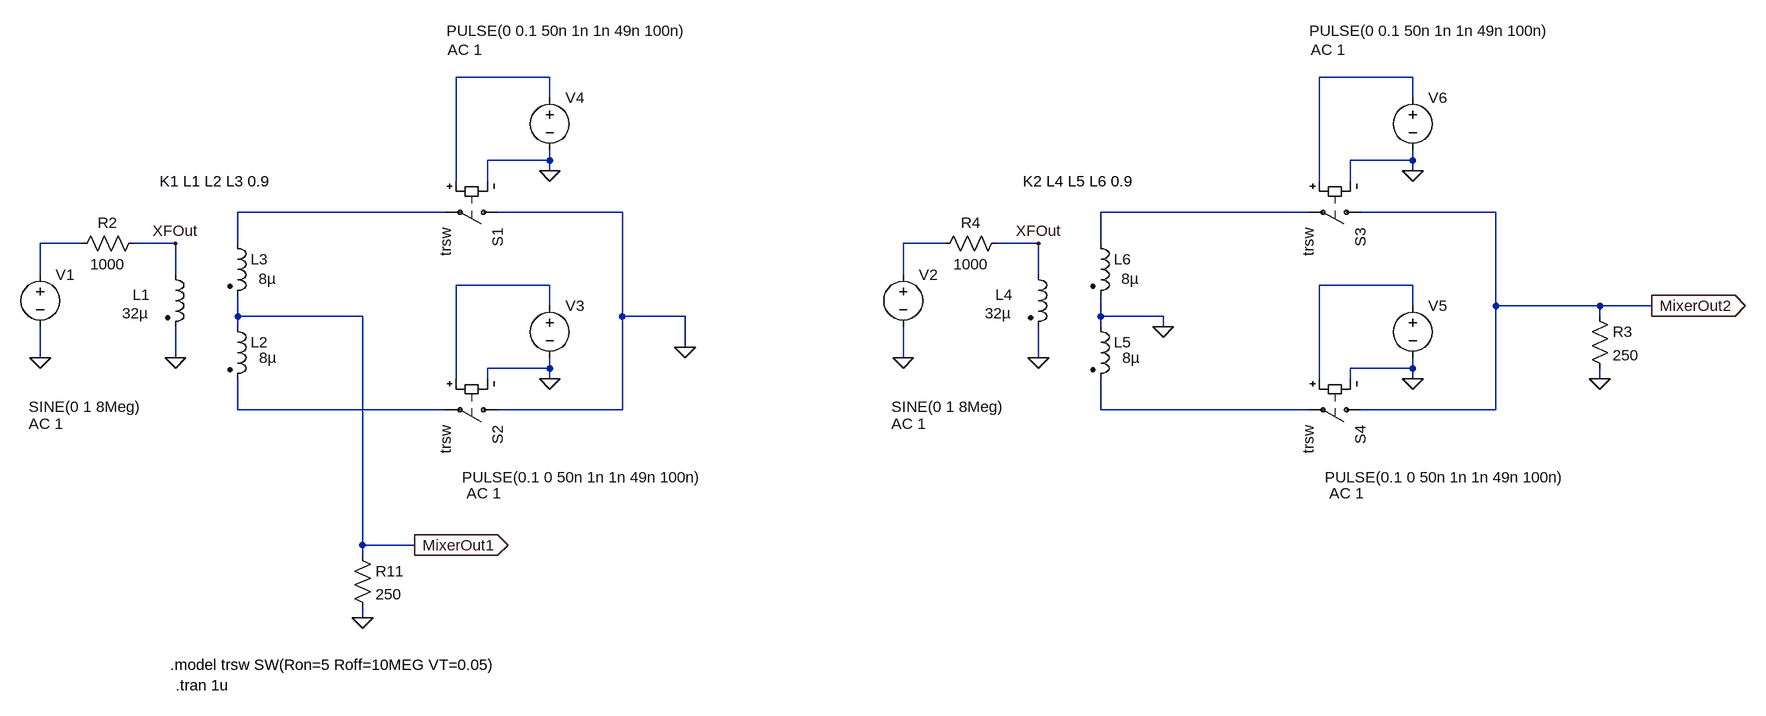
[diagram p0: schematic T2Mixer_comp.asc]
T2Mixer_comp.asc, the LTspice schematic file:
Version 4
SHEET 1 2836 760
WIRE 704 -192 560 -192
WIRE 2032 -192 1888 -192
WIRE 704 -160 704 -192
WIRE 2032 -160 2032 -192
WIRE 704 -64 704 -80
WIRE 704 -64 608 -64
WIRE 2032 -64 2032 -80
WIRE 2032 -64 1936 -64
WIRE 704 -48 704 -64
WIRE 2032 -48 2032 -64
WIRE 560 -32 560 -192
WIRE 608 -32 608 -64
WIRE 1888 -32 1888 -192
WIRE 1936 -32 1936 -64
WIRE 544 16 224 16
WIRE 816 16 624 16
WIRE 1872 16 1552 16
WIRE 2160 16 1952 16
WIRE -16 64 -80 64
WIRE 128 64 64 64
WIRE 224 64 224 16
WIRE 1312 64 1248 64
WIRE 1456 64 1392 64
WIRE 1552 64 1552 16
WIRE -80 112 -80 64
WIRE 128 112 128 64
WIRE 1248 112 1248 64
WIRE 1456 112 1456 64
WIRE 704 128 560 128
WIRE 2032 128 1888 128
WIRE 704 160 704 128
WIRE 2032 160 2032 128
WIRE 2160 160 2160 16
WIRE 2320 160 2160 160
WIRE 2400 160 2320 160
WIRE 224 176 224 144
WIRE 416 176 224 176
WIRE 816 176 816 16
WIRE 912 176 816 176
WIRE 1552 176 1552 144
WIRE 1648 176 1552 176
WIRE 2320 176 2320 160
WIRE 224 192 224 176
WIRE 1552 192 1552 176
WIRE 1648 192 1648 176
WIRE 912 224 912 176
WIRE -80 240 -80 192
WIRE 128 240 128 192
WIRE 1248 240 1248 192
WIRE 1456 240 1456 192
WIRE 704 256 704 240
WIRE 704 256 608 256
WIRE 2032 256 2032 240
WIRE 2032 256 1936 256
WIRE 560 272 560 128
WIRE 608 272 608 256
WIRE 704 272 704 256
WIRE 1888 272 1888 128
WIRE 1936 272 1936 256
WIRE 2032 272 2032 256
WIRE 2320 272 2320 256
WIRE 224 320 224 272
WIRE 544 320 224 320
WIRE 816 320 816 176
WIRE 816 320 624 320
WIRE 1552 320 1552 272
WIRE 1872 320 1552 320
WIRE 2160 320 2160 160
WIRE 2160 320 1952 320
WIRE 416 528 416 176
WIRE 496 528 416 528
WIRE 416 544 416 528
WIRE 416 640 416 624
FLAG 416 640 0
FLAG 128 240 0
FLAG -80 240 0
FLAG 912 224 0
FLAG 704 -48 0
FLAG 704 272 0
FLAG 496 528 MixerOut1
IOPIN 496 528 Out
FLAG 128 64 XFOut
FLAG 2320 272 0
FLAG 1456 240 0
FLAG 1248 240 0
FLAG 2032 -48 0
FLAG 2032 272 0
FLAG 2400 160 MixerOut2
IOPIN 2400 160 Out
FLAG 1456 64 XFOut
FLAG 1648 192 0
SYMBOL ind2 112 96 R0
WINDOW 3 -66 75 Left 2
WINDOW 0 -50 47 Left 2
SYMATTR Value 32µ
SYMATTR InstName L1
SYMATTR SpiceLine Rser=1 Rpar=1k
SYMBOL ind2 208 176 R0
WINDOW 3 49 64 Left 2
SYMATTR Value 8µ
SYMATTR InstName L2
SYMATTR SpiceLine Rser=1 Rpar=1k
SYMBOL ind2 208 48 R0
WINDOW 3 48 70 Left 2
SYMATTR Value 8µ
SYMATTR InstName L3
SYMATTR SpiceLine Rser=1 Rpar=1k
SYMBOL sw 640 16 R90
SYMATTR InstName S1
SYMATTR Value trsw
SYMBOL sw 640 320 R90
SYMATTR InstName S2
SYMATTR Value trsw
SYMBOL res 400 528 R0
SYMATTR InstName R11
SYMATTR Value 250
SYMBOL res 80 48 R90
WINDOW 0 0 56 VBottom 2
WINDOW 3 32 56 VTop 2
SYMATTR InstName R2
SYMATTR Value 1000
SYMBOL voltage -80 96 R0
WINDOW 3 -18 219 Left 2
WINDOW 123 -18 245 Left 2
WINDOW 39 0 0 Left 0
SYMATTR Value SINE(0 1 8Meg)
SYMATTR Value2 AC 1
SYMATTR InstName V1
SYMBOL voltage 704 144 R0
WINDOW 3 -135 280 Left 2
WINDOW 123 -128 304 Left 2
WINDOW 39 0 0 Left 0
SYMATTR Value PULSE(0.1 0 50n 1n 1n 49n 100n)
SYMATTR Value2 AC 1
SYMATTR InstName V3
SYMBOL voltage 704 -176 R0
WINDOW 3 -159 -87 Left 2
WINDOW 123 -157 -58 Left 2
WINDOW 39 0 0 Left 0
SYMATTR Value PULSE(0 0.1 50n 1n 1n 49n 100n)
SYMATTR Value2 AC 1
SYMATTR InstName V4
SYMBOL ind2 1440 96 R0
WINDOW 3 -66 75 Left 2
WINDOW 0 -50 47 Left 2
SYMATTR Value 32µ
SYMATTR InstName L4
SYMATTR SpiceLine Rser=1 Rpar=1k
SYMBOL ind2 1536 176 R0
WINDOW 3 49 64 Left 2
SYMATTR Value 8µ
SYMATTR InstName L5
SYMATTR SpiceLine Rser=1 Rpar=1k
SYMBOL ind2 1536 48 R0
WINDOW 3 48 70 Left 2
SYMATTR Value 8µ
SYMATTR InstName L6
SYMATTR SpiceLine Rser=1 Rpar=1k
SYMBOL sw 1968 16 R90
SYMATTR InstName S3
SYMATTR Value trsw
SYMBOL sw 1968 320 R90
SYMATTR InstName S4
SYMATTR Value trsw
SYMBOL res 2304 160 R0
SYMATTR InstName R3
SYMATTR Value 250
SYMBOL res 1408 48 R90
WINDOW 0 0 56 VBottom 2
WINDOW 3 32 56 VTop 2
SYMATTR InstName R4
SYMATTR Value 1000
SYMBOL voltage 1248 96 R0
WINDOW 3 -18 219 Left 2
WINDOW 123 -18 245 Left 2
WINDOW 39 0 0 Left 0
SYMATTR Value SINE(0 1 8Meg)
SYMATTR Value2 AC 1
SYMATTR InstName V2
SYMBOL voltage 2032 144 R0
WINDOW 3 -135 280 Left 2
WINDOW 123 -128 304 Left 2
WINDOW 39 0 0 Left 0
SYMATTR Value PULSE(0.1 0 50n 1n 1n 49n 100n)
SYMATTR Value2 AC 1
SYMATTR InstName V5
SYMBOL voltage 2032 -176 R0
WINDOW 3 -159 -87 Left 2
WINDOW 123 -157 -58 Left 2
WINDOW 39 0 0 Left 0
SYMATTR Value PULSE(0 0.1 50n 1n 1n 49n 100n)
SYMATTR Value2 AC 1
SYMATTR InstName V6
TEXT 104 -32 Left 2 !K1 L1 L2 L3 0.9
TEXT 120 712 Left 2 !.model trsw SW(Ron=5 Roff=10MEG VT=0.05)
TEXT 128 744 Left 2 !.tran 1u
TEXT 1432 -32 Left 2 !K2 L4 L5 L6 0.9

The netlist it stands for:
* T2Mixer_comp.asc
L1 XFOut 0 32µ Rser=1 Rpar=1k
L2 MixerOut1 N009 8µ Rser=1 Rpar=1k
L3 N003 MixerOut1 8µ Rser=1 Rpar=1k
S1 0 N003 N001 0 trsw
S2 0 N009 N007 0 trsw
R11 MixerOut1 0 250
R2 XFOut N005 1000
V1 N005 0 SINE(0 1 8Meg) AC 1
V3 N007 0 PULSE(0.1 0 50n 1n 1n 49n 100n) AC 1
V4 N001 0 PULSE(0 0.1 50n 1n 1n 49n 100n) AC 1
L4 XFOut 0 32µ Rser=1 Rpar=1k
L5 0 N010 8µ Rser=1 Rpar=1k
L6 N004 0 8µ Rser=1 Rpar=1k
S3 MixerOut2 N004 N002 0 trsw
S4 MixerOut2 N010 N008 0 trsw
R3 MixerOut2 0 250
R4 XFOut N006 1000
V2 N006 0 SINE(0 1 8Meg) AC 1
V5 N008 0 PULSE(0.1 0 50n 1n 1n 49n 100n) AC 1
V6 N002 0 PULSE(0 0.1 50n 1n 1n 49n 100n) AC 1
K1 L1 L2 L3 0.9
.model trsw SW(Ron=5 Roff=10MEG VT=0.05)
.tran 1u
K2 L4 L5 L6 0.9
.backanno
.end